# Altium schematic sheet Adder.SchDoc
size A; SheetNumber: 4; SheetTotal: 4
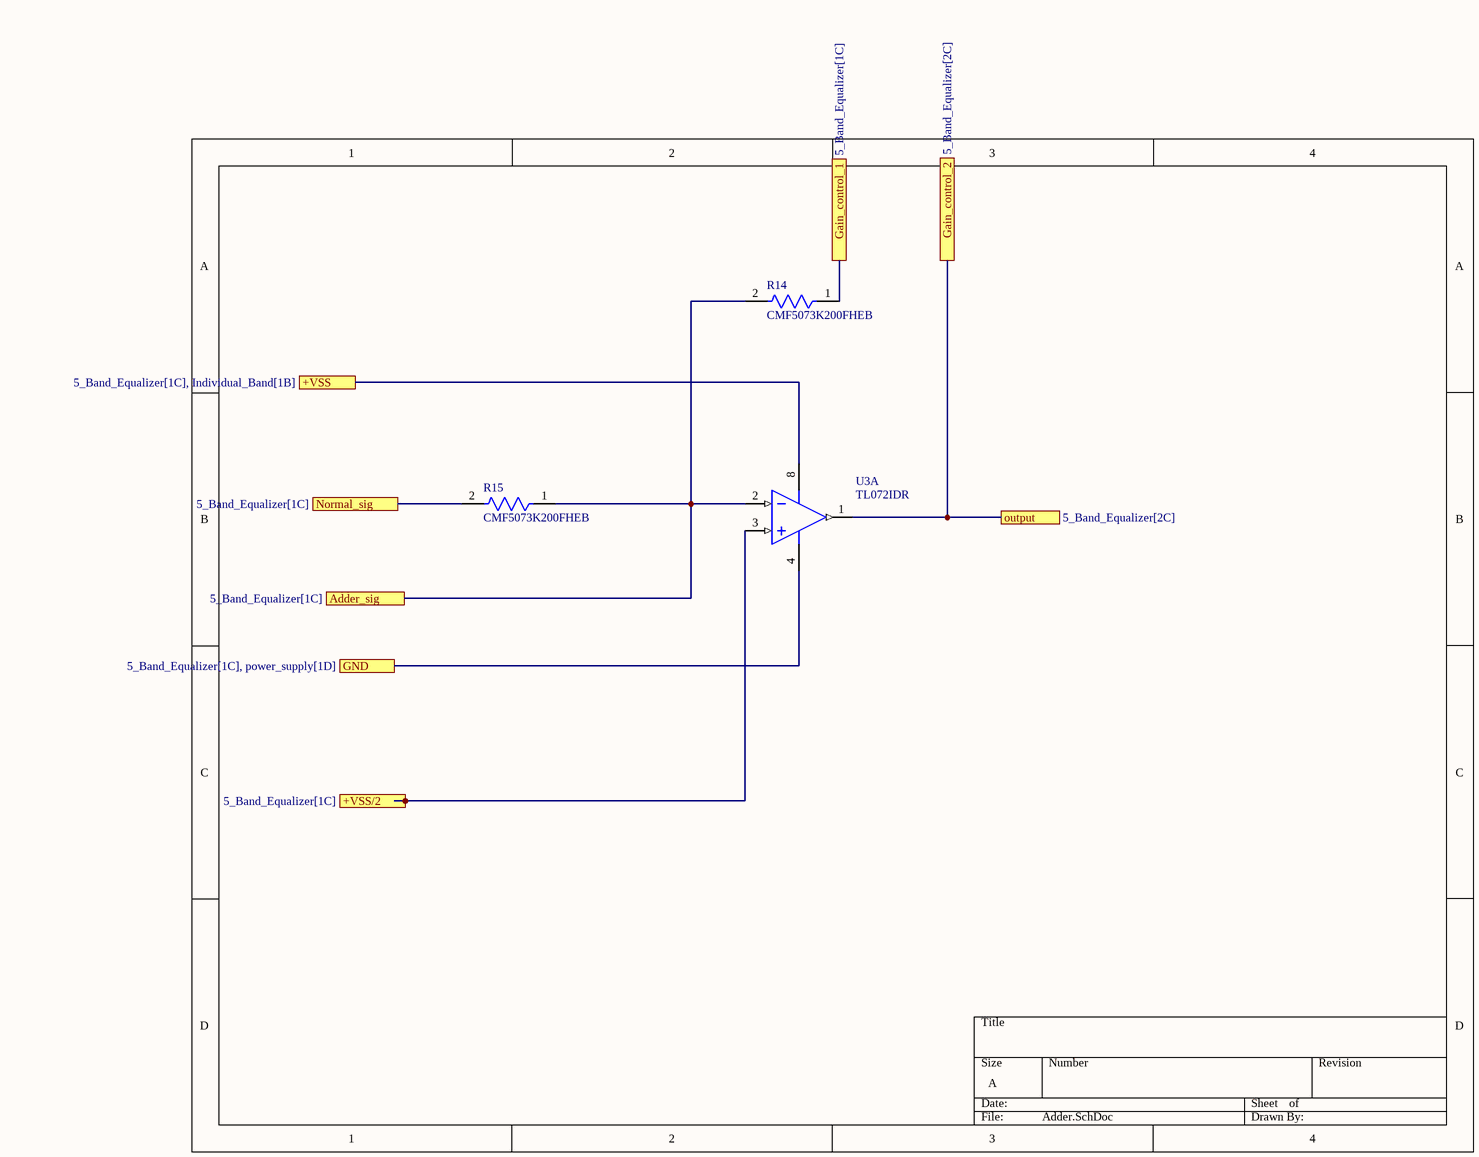
[diagram p0: Adder.SchDoc]

## Parts
R14  CMF5073K200FHEB  [FP-CMF50-0]
R15  CMF5073K200FHEB  [FP-CMF50-0]
U3  TL072IDR  [D0008A_L]  (part A of 2)

## Ports
+VSS (see 5_Band_Equalizer[1C], Individual_Band[1B]), +VSS/2 (see 5_Band_Equalizer[1C]), Adder_sig (see 5_Band_Equalizer[1C]), Gain_control_1 (see 5_Band_Equalizer[1C]), Gain_control_2 (see 5_Band_Equalizer[2C]), GND (see 5_Band_Equalizer[1C], power_supply[1D]), Normal_sig (see 5_Band_Equalizer[1C]), output (see 5_Band_Equalizer[2C])

## Nets
+VSS: U3.8(VCC+) ; port +VSS
+VSS/2: U3.3(IN1+) ; port +VSS/2
Adder_sig: R14.2 R15.1 U3.2(IN1-) ; port Adder_sig
Gain_control_1: R14.1 ; port Gain_control_1
Gain_control_2: U3.1(OUT1) ; port Gain_control_2, port output
GND: U3.4(VCC-) ; port GND
Normal_sig: R15.2 ; port Normal_sig

## Library data of the parts
R14 R15 = CMP-00030-44386654-1: CMF5073K200FHEB Res Metal Film 73.2K Ohm 1% 0.125W(1/8W) ±50ppm/°C Epoxy AXL T/R; Max Power Dissipation: 250mW; Voltage Rating: 200V; Power Rating: 125mW; Resistance: 73.2kΩ; Tolerance: 1%; Width: 1.65mm; Length: 3.81mm; Schedule B: 8533210090, 8533210090; Termination: Axial; Lead Free: Lead Free; Diameter: 1.65mm; Voltage Rating (DC): 200V; NexarPartId: 44386654; Packaging: Cut Tape; Max Operating Temperature: 175°C; Composition: Metal Film; RoHS: Compliant; Mount: Through Hole; Features: Flame Retardant Coating, Moisture Resistant; Number of Terminations: 2; Temperature Coefficient: 50ppm/°C; Min Operating Temperature: -55°C; Case/Package: Axial
U3 = CMP-0015-00084-2: Dual Low-Noise JFET-Input General-Purpose Operational Amplifier, 7 to 36 V, -40 to 85 degC, 8-pin SOIC (D8), Green (RoHS & no Sb/Br); Manufacturer: Texas Instruments; Number of Channels: 2; Rating: Catalog; IIB(Max)(pA): 200; Total Supply Voltage(Max)(+5V is 5, +/-5V is 10): 36; Vio (25C)(Max)(mV): 6; Iq per channel(Max)(mA): 2.5; Offset Drift(Typ)(uV/C): 18; Total Supply Voltage(Min)(+5V is 5, +/-5V is 10): 7; CMRR(Min)(dB): 75; Slew Rate(Typ)(V/us): 13; Sub Family: General Purpose Amplifier, High Supply Voltage Amplifier (>=30V); GBW(Typ)(MHz): 3; Code_JEDEC: MS-012; Eco-Plan: Green (RoHS & no Sb/Br); Mounting Technology: Surface Mount; ComponentLink3Description: Package Specification; PackageReference: D0008A; ComponentLink2URL: http://www.ti.com/lit/ds/symlink/tl072.pdf; ComponentLink1Description: Manufacturer URL; ComponentLink3URL: http://www.ti.com/litv/pdf/msoi002j; ComponentLink2Description: Datasheet; DatasheetVersion: SLOS080J; ComponentLink1URL: http://www.ti.com/; PackageDescription: 8-Pin Plastic Small Outline, Body 4.9 x 3.9 mm, Pitch 1.27 mm; PackageVersion: 4040047-3/M, 06/2011; Vn at 1kHz(Typ)(nV/rtHz): 18; PartNumber: TL072IDR